# Altium project subsystem_intro_prj.PrjPcb
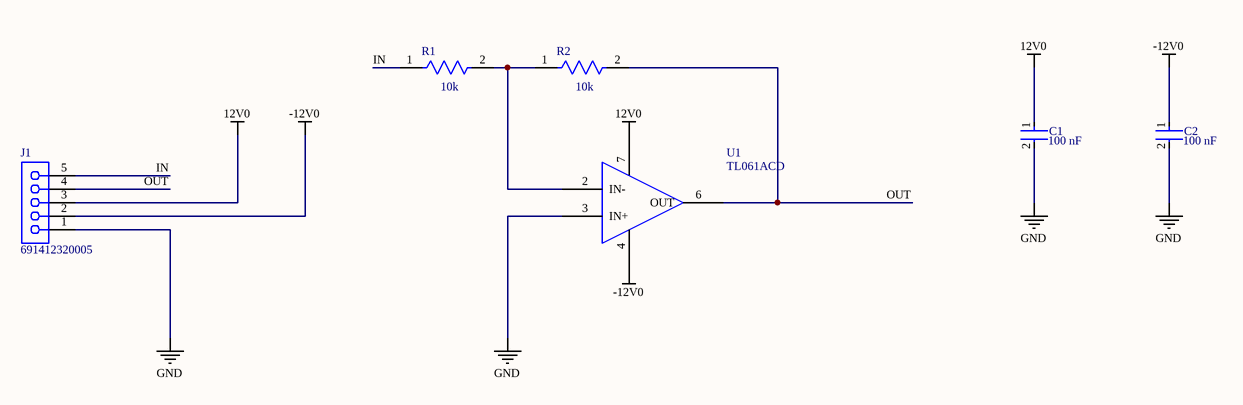
[diagram p0: subsystem_intro_prj.SchDoc]
1 sheet, 6 parts. Net scope: global (net labels, ports and power ports of the same name join across sheets).
Board file: subsystem_intro_prj.PcbDoc

## Sheet subsystem_intro_prj.SchDoc
size A; SheetNumber: 1; SheetTotal: 1

### Parts
C1  Capacitance: 100 nF  [FP-CC0805-0_85-MFG]  (hidden comment: CC0805KRX7R9BB104)
C2  Capacitance: 100 nF  [FP-CC0805-0_85-MFG]  (hidden comment: CC0805KRX7R9BB104)
J1  691412320005  [691412320005]
R1  Resistance: 10k  [FP-RR1220-IPC_A]  (hidden comment: RR1220P-103-D)
R2  Resistance: 10k  [FP-RR1220-IPC_A]  (hidden comment: RR1220P-103-D)
U1  TL061ACD  [TL061ACD]

### Nets
12V0: C1.1 J1.3 U1.7(VCC+)
-12V0: C2.1 J1.2 U1.4(VCC-)
GND: C1.2 C2.2 J1.1 U1.3(IN+)
IN: J1.5 R1.1
OUT: J1.4 R2.2 U1.6(OUT)
NetR1_2: R1.2 R2.1 U1.2(IN-)

### Library data of the parts
C1 C2 = CMP-2100-03606-3: CAP CER 0.1UF 50V X7R 0805; Manufacturer: Yageo; Tolerance: 0.1; Value: 100 nF; Description: CC0805 100 nF X7R 10.00% 50 V; Material: Ceramic; Device Class L1: Passive Components; ComponentLink2Description: Datasheet; Package: CC0805-0.85; Manufacturer Part Number: CC0805KRX7R9BB104; Digikey Description: CAP CER 0.1UF 50V X7R 0805; Device Class L3: Ceramic Capacitors; Temperature: -30°C to +85°C; Temperature Characteristic: X7R; Voltage Rating: 50 V; Height: 0.95mm; RoHS: TRUE; Ipc Land Pattern Name: CAPC200125X85; Device Class L2: Capacitors; Category: Cap; Temperature Range Low: -30°C; Temperature Range High: +85°C; Mouser Description: Multilayer Ceramic Capacitors MLCC - SMD/SMT 100nF 50V X7R 10%; Footprint Url: http://www.yageo.com/exep/pages/download/literatures/UPY-C_GEN_24.pdf; Automotive: No; Octopart: https://octopart.com/cc0805krx7r9bb104-yageo-192993; Lead Free: Yes; ComponentLink2URL: http://www.yageo.com/documents/recent/UPY-GPHC_Y5V_6.3V-to-50V_8.pdf
J1 = CMP-1502-02954-2: NexarPartId: 78871498; Number of Pins: 5; Lead Pitch: 3.81mm; RoHS: Non-Compliant; Packaging: Box
R1 R2 = CMP-2001-03215-2: 10kΩ ±0.5% 0.1W 1/10W Chip Resistor 0805 (2012 Metric) Thin Film; Max Power Dissipation: 100mW; Voltage Rating: 100V; Temperature Coefficient: 25ppm/°C; Size Code: 0805; RoHS Compliant: Yes; Package Quantity: 1; Resistance Tolerance: 0.5%; Depth: 1.25mm; Lead Free: Lead Free; Series: RR; Min Operating Temperature: -55°C; Weight: 0.000194oz; Width: 1.25mm; Packaging: Tape and Reel; Termination: SMD/SMT; Length: 2mm; Power Rating: 100mW; Case Code (Metric): 2012; Resistor Type: Thin Film; Height: 0.4mm; Case/Package: 0805; Case Code (Imperial): 0805; Technology: THIN FILM; Max Operating Temperature: 125°C; Voltage Rating (DC): 100V; Number of Terminations: 2; Tolerance: 0.5%